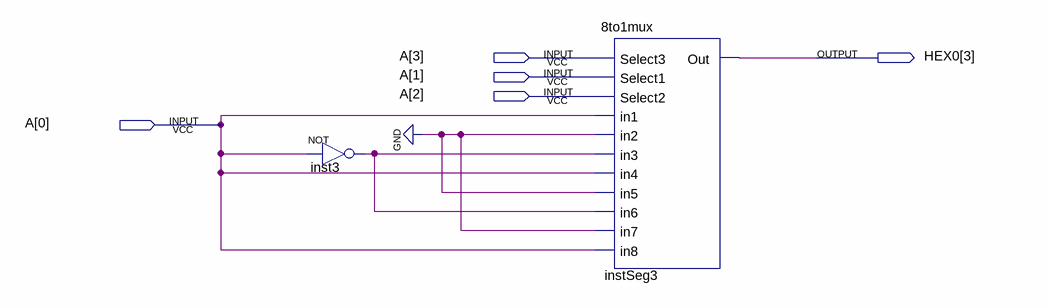
[diagram p0: schematic sheet]
// Quartus schematic seg3.bdf as structural Verilog: 2 symbols, 5 pins
module seg3 (
  input  [3:0] A,
  output [3:3] HEX0
);

  wire inst3_out;

  not inst3 (inst3_out, A[0]);
  \8to1mux  instSeg3 (
    .Select3(A[3]), .Select1(A[1]), .Select2(A[2]), .in1(A[0]), .in2(1'b0), .in3(inst3_out), .in4(A[0]),
    .in5(1'b0), .in6(inst3_out), .in7(1'b0), .in8(A[0]), .Out(HEX0[3]));
endmodule
